# Altium schematic sheet Sheet1.SchDoc
size A; SheetNumber: 1; SheetTotal: 1
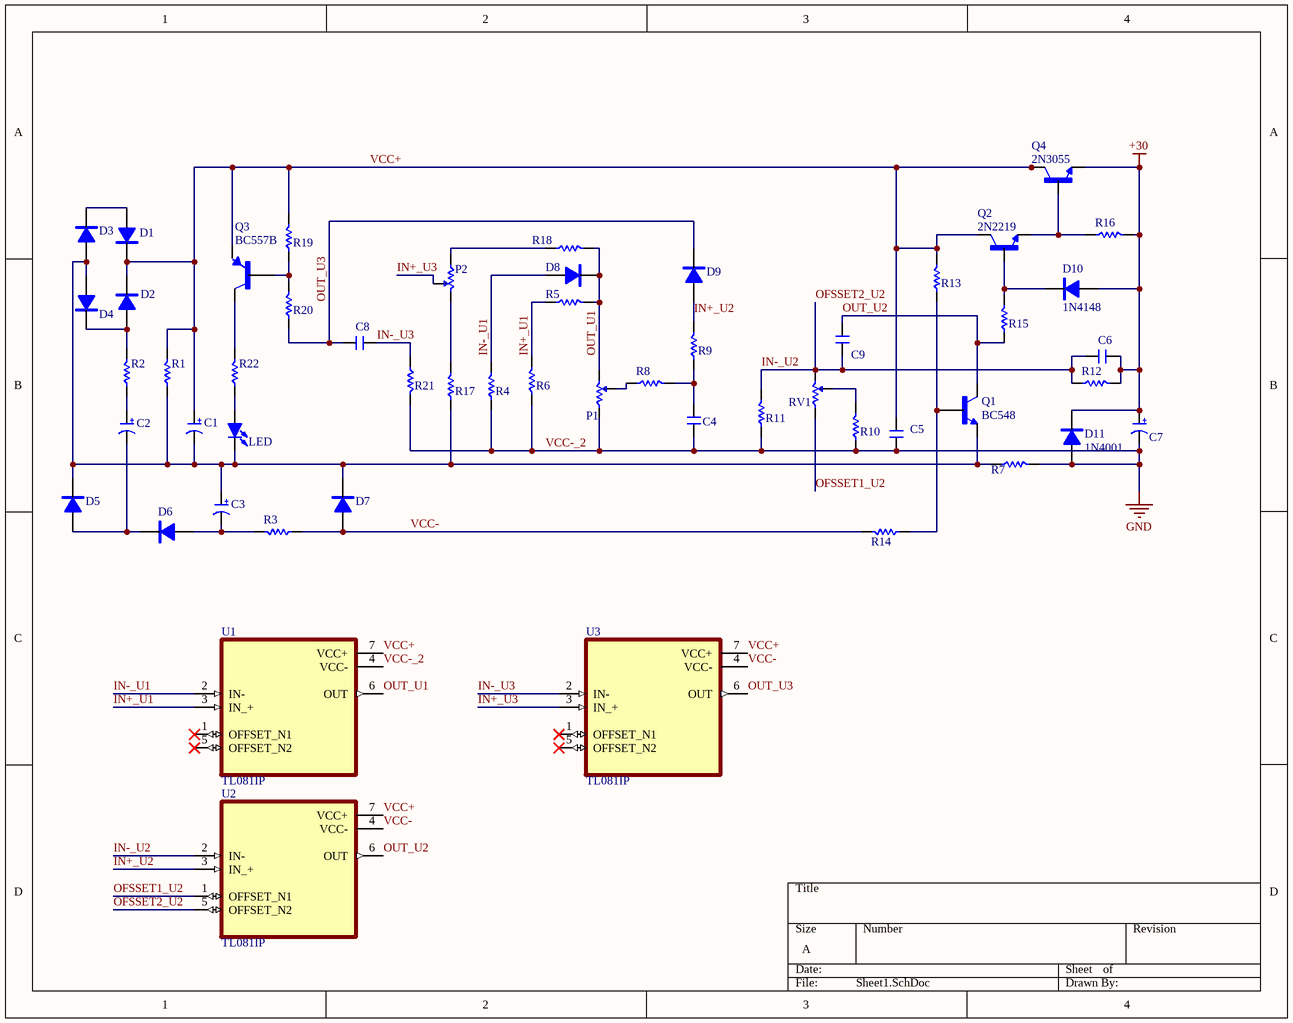
[diagram p0: Sheet1.SchDoc]

## Parts
C1  3300uF/50V  [CAP 7.5*18*35.5-H - GD]  (value not drawn)
C2  47uF/50V  [CAP 2.5*6.3*7]  (value not drawn)
C3  47uF/50V  [CAP 2.5*6.3*7]  (value not drawn)
C4  100nF///  [CBB 10*12*8]  (value not drawn)
C5  220nF  [CBB 10*12*8]  (value not drawn)
C6  100pF  [CC 2.2*5]  (value not drawn)
C7  10uF/50V  [CAP 1.5*4*8]  (value not drawn)
C8  330pF///  [CC 2.2*5]  (value not drawn)
C9  100pF  [CC 2.2*5]  (value not drawn)
D1  1N5402,3,4,5,6,7,8  [DO-41]  (value not drawn)
D2  1N5402,3,4,5,6,7,8  [DO-41]  (value not drawn)
D3  1N5402,3,4,5,6,7,8  [DO-41]  (value not drawn)
D4  1N5402,3,4,5,6,7,8  [DO-41]  (value not drawn)
D5  1N4148  [DO-35]  (value not drawn)
D6  1N4148  [DO-35]  (value not drawn)
D7  5,6V Zener  [DO-41]  (value not drawn)
D8  5,6V Zener  [DO-41]  (value not drawn)
D9  1N4148  [DO-35]  (value not drawn)
D10  1N4148  [DO-35]
D11  1N4001  [DO-41]
LED  红色  [LED 5MM-R]  (value not drawn)
P1  (no value)  [WH148]
P2  (no value)  [WH148]
Q1  BC548  [TO92127P520H533-3]
Q2  2N2219  [TO5]
Q3  BC557B  [TO127P254X732-3]
Q4  2N3055  [TO3]
R1  2.2K  [RS 1/4W]  (value not drawn)
R2  82  [RS 1/4W]  (value not drawn)
R3  220  [RS 1/4W]  (value not drawn)
R4  4.7K  [RS 1/4W]  (value not drawn)
R5  10K  [RS 1/4W]  (value not drawn)
R6  10K  [RS 1/4W]  (value not drawn)
R7  0.47  [RS 5W]  (value not drawn)
R8  27K  [RS 1/4W]  (value not drawn)
R9  2.2K  [RS 1/4W]  (value not drawn)
R10  270K  [RS 1/4W]  (value not drawn)
R11  27K  [RS 1/4W]  (value not drawn)
R12  56K  [RS 1/4W]  (value not drawn)
R13  10K  [RS 1/4W]  (value not drawn)
R14  1.5K  [RS 1/4W]  (value not drawn)
R15  1K  [RS 1/4W]  (value not drawn)
R16  1K  [RS 1/4W]  (value not drawn)
R17  33  [RS 1/4W]  (value not drawn)
R18  56K  [RS 1/4W]  (value not drawn)
R19  2.2K  [RS 1/4W]  (value not drawn)
R20  10K  [RS 1/4W]  (value not drawn)
R21  10K  [RS 1/4W]  (value not drawn)
R22  3.9K  [RS 1/4W]  (value not drawn)
RV1  100K  [3296W]  (value not drawn)
U1  TL081IP  [DIP794W45P254L959H508Q8]
U2  TL081IP  [DIP794W45P254L959H508Q8]
U3  TL081IP  [DIP794W45P254L959H508Q8]

## Nets
+30: C6.2 C7.1(A) D10.1(A) D11.2(K) Q4.E R12.2 R16.2
VCC-_2: C4.1 C5.1 C7.2(K) D11.1(A) P1.1 R4.1 R6.1 R7.2 R10.1 R11.1 R21.2 U1.4(VCC-)  [also labelled GND]
IN+_U1: R5.1 R6.2 U1.3(IN_+)
IN+_U2: D9.1(A) R9.2 U2.3(IN_+)
IN+_U3: P2.ADJ U3.3(IN_+)
IN-_U1: D8.1(A) R4.2 U1.2(IN-)
IN-_U2: C6.1 C9.1 R11.2 R12.1 RV1.2 U2.2(IN-) U2.5(OFFSET_N2)  [also labelled OFSSET2_U2]
IN-_U3: C8.1 R21.1 U3.2(IN-)
OFSSET1_U2: RV1.1 U2.1(OFFSET_N1)
OUT_U1: D8.2(K) P1.2 R5.2 R18.2 U1.6(OUT)
OUT_U2: C9.2 Q1.1(C) R15.1 U2.6(OUT)
OUT_U3: C8.2 D9.2(K) R20.1 U3.6(OUT)
VCC+: C1.1(A) C5.2 D1.2(K) D2.2(K) Q2.3(C) Q3.3(E) Q4.C Q4.C/(C) R1.2 R13.2 R19.2 U1.7(VCC+) U2.7(VCC+) U3.7(VCC+)
VCC-: D7.1(A) R3.1 R14.2 U2.4(VCC-) U3.4(VCC-)
NetC1_2: C1.2(K) C3.1(A) D3.1(A) D4.1(A) D5.2(K) D7.2(K) LED.2(K) Q1.3(E) R1.1 R7.1 R17.1
NetC2_1: C2.1(A) R2.1
NetC2_2: C2.2(K) D5.1(A) D6.2(K)
NetC3_2: C3.2(K) D6.1(A) R3.2
NetC4_2: C4.2 R8.2 R9.1
NetD1_1: D1.1(A) D3.2(K)
NetD2_1: D2.1(A) D4.2(K) R2.2
NetD10_2: D10.2(K) Q2.2(B) R15.2
NetLED_1: LED.1(A) R22.1
NetP1_ADJ: P1.ADJ R8.1
NetP2_1: P2.1 R18.1
NetP2_2: P2.2 R17.2
NetQ1_2: Q1.2(B) R13.1 R14.1
NetQ2_1: Q2.1(E) Q4.B R16.1
NetQ3_1: Q3.1(C) R22.2
NetQ3_2: Q3.2(B) R19.1 R20.2
NetR10_2: R10.2 RV1.ADJ

Not connected (* = marked no-connect by the designer): U1 1(OFFSET_N1)* 5(OFFSET_N2)*; U3 1(OFFSET_N1)* 5(OFFSET_N2)*

## Notes on the sheet
- (in symbol C-CAP) +

## Library data of the parts
C1-C3 C7 = C-CAP: Inline electrolytic capacitor; BOM名称: 直插电解电容; 版权归属: 源创客; 学习资源: www.ooocke.com
C4 C5 = C-CBB: CBB capacitor; BOM名称: CBB电容; 版权归属: 源创客; 学习资源: www.ooocke.com
C6 C8 C9 = C-CC: Straight insert ceramic capacitor; BOM名称: 直插瓷片电容; 版权归属: 源创客; 学习资源: www.ooocke.com
D1-D4 D7 D8 D11 = 1N4007: Rectifier diode; BOM名称: 整流二极管; 版权归属: 源创客; 学习资源: www.ooocke.com
D5 D6 D9 D10 = 1N4148: High speed switching diode; BOM名称: 高速开关二极管; 版权归属: 源创客; 学习资源: www.ooocke.com
LED = LED-5MM: 5mm plug-in LED; BOM名称: 5mm插件LED; 版权归属: 源创客; 学习资源: www.ooocke.com
P1 P2 RV1 = RP-THD: Plug-in potentiometer; BOM名称: 插件电位器; 版权归属: 源创客; 学习资源: www.ooocke.com
Q1 = BC548: Bipolar (BJT) Transistor NPN 30V 100mA 300MHz 500mW Through Hole TO-92-3; MF: ON Semiconductor; DigiKey-Purchase-URL: https://snapeda.com/shop?store=DigiKey&id=2007035; MP: BC548; Availability: Warning; Package: TO-92 ON Semiconductor; Value: *; SnapEDA_Link: https://www.snapeda.com/parts/BC548/ON%20Semiconductor/view-part/2007035/?ref=snap; Price: None
Q2 = 2N2219: Bipolar _BJT_ Transistor NPN 30V 800mA 800mW Through Hole TO-39 _TO-205AD_; MF: Microsemi; SnapEDA_Link: https://www.snapeda.com/parts/2N2219/Microsemi/view-part/4701669/?ref=snap; Availability: Unavailable; MP: 2N2219; Value: *; Price: None; Package: TO-39 Microsemi
Q3 = BC557B: Tranzistor bipolar _BJT_ PNP 45V 100mA 320MHz 625mW Gura de trecere TO-92-3; MF: Diotec Semiconductor; Value: *; MP: BC557B; Package: TO-226-3 Diotec Semiconductor; Availability: Unavailable; SnapEDA_Link: https://www.snapeda.com/parts/BC557B/Diotec/view-part/4702102/?ref=snap; Price: None
Q4 = 2N3055: Bipolar _BJT_ Transistor NPN 60V 15A 2.5MHz 115W Through Hole TO-3; MF: STMicroelectronics; SnapEDA_Link: https://www.snapeda.com/parts/2N3055/STMicroelectronics/view-part/2753103/?ref=snap; MP: 2N3055; Price: None; Value: *; Availability: Unavailable; Package: TO-3 RCA
R1-R22 = R-CRR: Straight color ring resistor; BOM名称: 色环电阻; 版权归属: 源创客; 学习资源: www.ooocke.com
U1-U3 = TL081IP: Amplificador operacional de entrada JFET de alta velocidad de respuesta 8-PDIP -40 a 85; MF: Texas Instruments; Value: *; Check_prices: https://www.snapeda.com/parts/TL081IP/Texas%20Instruments/view-part/558008/?ref=eda; Availability: Good; Price: None; MP: TL081IP; Package: PDIP-8 Texas; Purchase-URL: https://pricing.snapeda.com/search/part/TL081IP/?ref=eda; SnapEDA_Link: https://www.snapeda.com/parts/TL081IP/Texas%20Instruments/view-part/558008/?ref=snap